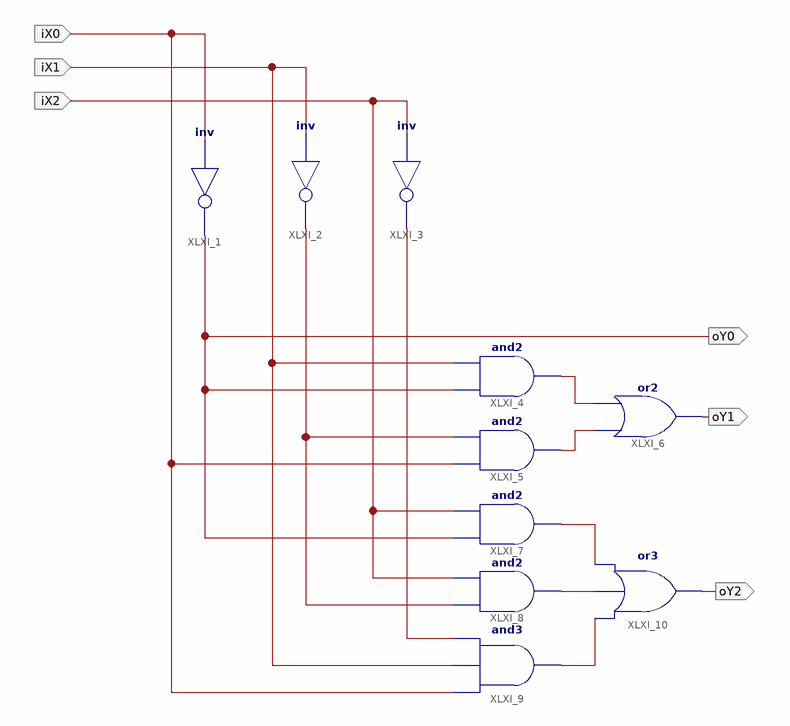
[diagram p0: schematic sheet 1]
// Xilinx ISE schematic MySecondDigitalSystem.sch (spartan6) as structural Verilog: 10 symbols, 6 ports
module MySecondDigitalSystem (
  input  iX0,
  input  iX1,
  input  iX2,
  output oY0,
  output oY1,
  output oY2
);

  wire XLXN_9, XLXN_10, XLXN_14, XLXN_15, XLXN_21, XLXN_22, XLXN_23;

  not XLXI_1 (oY0, iX0);
  not XLXI_2 (XLXN_9, iX1);
  not XLXI_3 (XLXN_10, iX2);
  and XLXI_4 (XLXN_15, oY0, iX1);
  and XLXI_5 (XLXN_14, iX0, XLXN_9);
  or XLXI_6 (oY1, XLXN_14, XLXN_15);
  and XLXI_7 (XLXN_21, oY0, iX2);
  and XLXI_8 (XLXN_22, XLXN_9, iX2);
  and XLXI_9 (XLXN_23, iX0, iX1, XLXN_10);
  or XLXI_10 (oY2, XLXN_23, XLXN_22, XLXN_21);
endmodule
